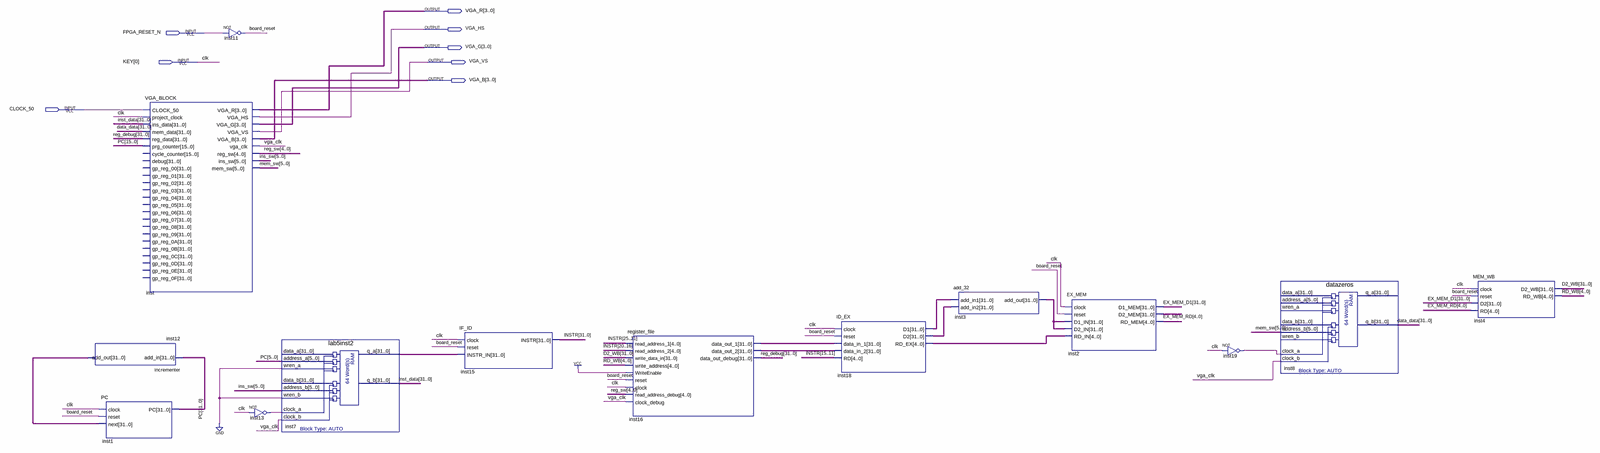
[diagram p0: schematic sheet, whole]
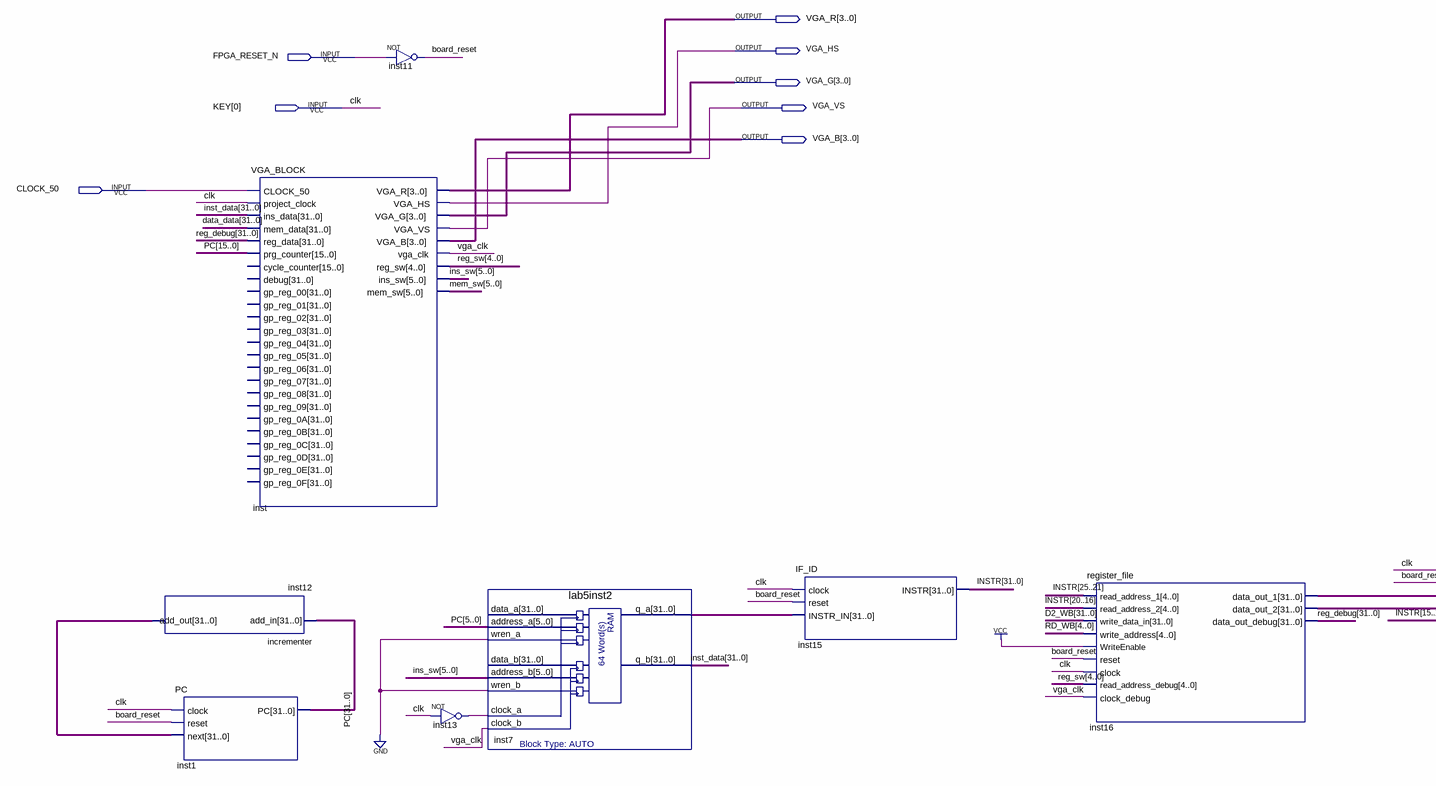
[diagram p1: schematic sheet, left part]
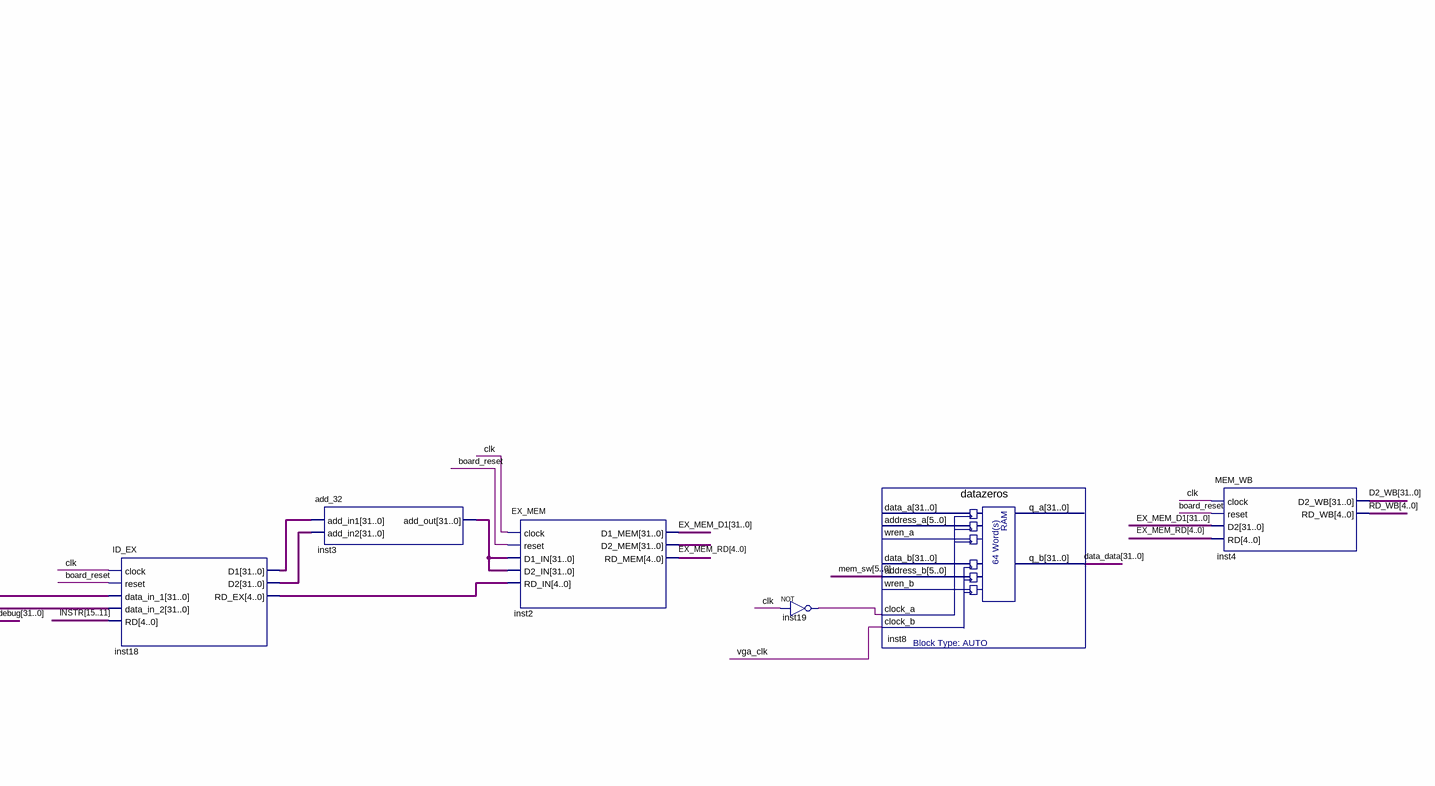
[diagram p2: schematic sheet, right part]
// Quartus schematic top.bdf as structural Verilog: 14 symbols, 8 pins
module top (
  input  FPGA_RESET_N,
  input  [0:0] KEY,
  input  CLOCK_50,
  output [3:0] VGA_R,
  output VGA_HS,
  output [3:0] VGA_G,
  output VGA_VS,
  output [3:0] VGA_B
);

  wire board_reset, inst13_out, inst19_out, vga_clk;
  wire [4:0] EX_MEM_RD, inst18_rd_ex, RD_WB, reg_sw;
  wire [5:0] ins_sw, mem_sw;
  wire [31:0] D2_WB, data_data, EX_MEM_D1, inst2_d2_mem, inst3_add_out, inst7_q_a, inst12_add_out,
       inst16_data_out_1, inst16_data_out_2, inst18_d1, inst18_d2, inst_data, INSTR, PC, reg_debug;

  incrementer inst12 (.add_in(PC), .add_out(inst12_add_out));
  PC inst1 (.clock(KEY[0]), .reset(board_reset), .next(inst12_add_out), .PC(PC));
  VGA_BLOCK inst (
    .CLOCK_50(CLOCK_50), .project_clock(KEY[0]), .ins_data(inst_data), .mem_data(data_data),
    .reg_data(reg_debug), .prg_counter(PC[15:0]), .VGA_R(VGA_R), .VGA_HS(VGA_HS), .VGA_G(VGA_G),
    .VGA_VS(VGA_VS), .VGA_B(VGA_B), .vga_clk(vga_clk), .reg_sw(reg_sw), .ins_sw(ins_sw), .mem_sw(mem_sw));  // open: cycle_counter, debug, gp_reg_00, gp_reg_01, gp_reg_02, gp_reg_03, gp_reg_04, gp_reg_05, gp_reg_06, gp_reg_07, gp_reg_08, gp_reg_09, gp_reg_0A, gp_reg_0B, gp_reg_0C, gp_reg_0D, gp_reg_0E, gp_reg_0F
  not inst11 (board_reset, FPGA_RESET_N);
  not inst13 (inst13_out, KEY[0]);
  lab5inst2 inst7 (
    .address_a(PC[5:0]), .wren_a(1'b0), .address_b(ins_sw), .wren_b(1'b0), .clock_a(inst13_out),
    .clock_b(vga_clk), .q_a(inst7_q_a), .q_b(inst_data));  // open: data_a, data_b
  IF_ID inst15 (.clock(KEY[0]), .reset(board_reset), .INSTR_IN(inst7_q_a), .INSTR(INSTR));
  register_file inst16 (
    .read_address_1(INSTR[25:21]), .read_address_2(INSTR[20:16]), .write_data_in(D2_WB),
    .write_address(RD_WB), .WriteEnable(1'b1), .reset(board_reset), .clock(KEY[0]),
    .read_address_debug(reg_sw), .clock_debug(vga_clk), .data_out_1(inst16_data_out_1),
    .data_out_2(inst16_data_out_2), .data_out_debug(reg_debug));
  ID_EX inst18 (
    .clock(KEY[0]), .reset(board_reset), .data_in_1(inst16_data_out_1), .data_in_2(inst16_data_out_2),
    .RD(INSTR[15:11]), .D1(inst18_d1), .D2(inst18_d2), .RD_EX(inst18_rd_ex));
  add_32 inst3 (.add_in1(inst18_d1), .add_in2(inst18_d2), .add_out(inst3_add_out));
  EX_MEM inst2 (
    .clock(KEY[0]), .reset(board_reset), .D1_IN(inst3_add_out), .D2_IN(inst3_add_out), .RD_IN(inst18_rd_ex),
    .D1_MEM(EX_MEM_D1), .D2_MEM(inst2_d2_mem), .RD_MEM(EX_MEM_RD));
  not inst19 (inst19_out, KEY[0]);
  datazeros inst8 (
    .address_b(mem_sw), .clock_a(inst19_out), .clock_b(vga_clk), .q_b(data_data));  // open: data_a, address_a, wren_a, data_b, wren_b, q_a
  MEM_WB inst4 (.clock(KEY[0]), .reset(board_reset), .D2(EX_MEM_D1), .RD(EX_MEM_RD), .D2_WB(D2_WB), .RD_WB(RD_WB));

  // Other names for the same wires on the sheet: clk = KEY[0]
endmodule
